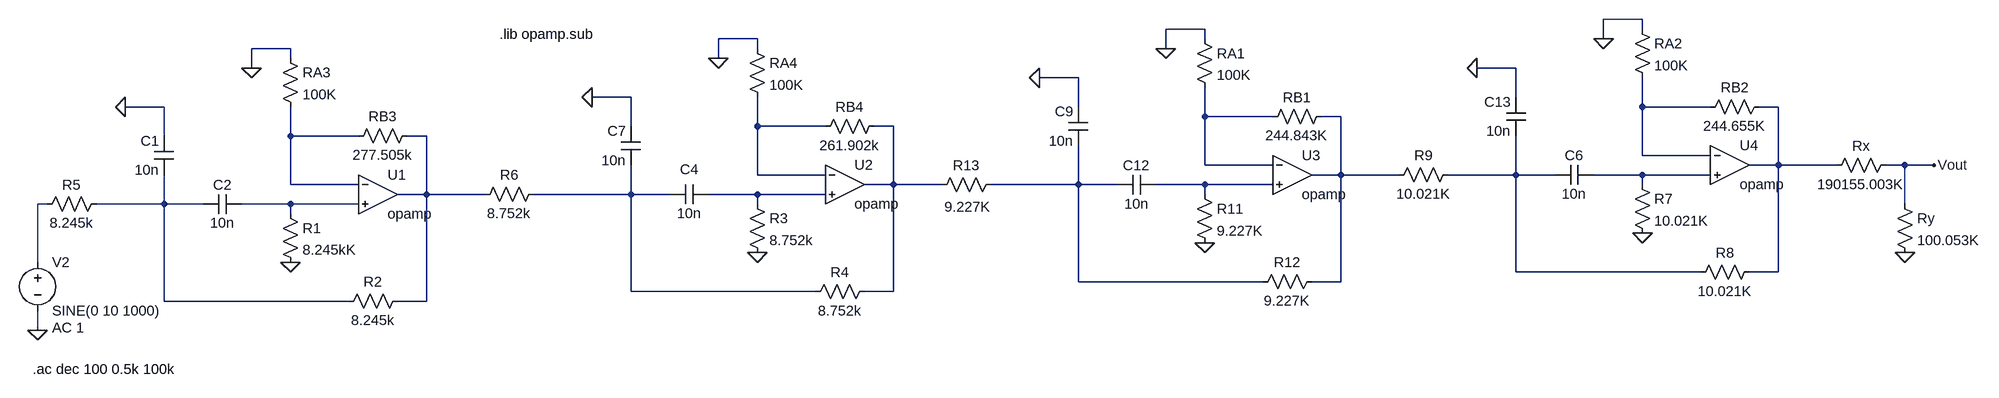
[diagram p0: schematic Passa_bandas wid.asc]
Passa_bandas wid.asc, the LTspice schematic file:
Version 4
SHEET 1 888 680
WIRE 288 -64 224 -64
WIRE -432 -48 -496 -48
WIRE 288 -48 288 -64
WIRE -1168 -32 -1232 -32
WIRE -432 -32 -432 -48
WIRE 224 -32 224 -64
WIRE -1936 -16 -2000 -16
WIRE -1168 -16 -1168 -32
WIRE -496 -16 -496 -48
WIRE -1936 0 -1936 -16
WIRE -1232 0 -1232 -32
WIRE -2000 16 -2000 -16
WIRE 80 16 16 16
WIRE -640 32 -704 32
WIRE -1376 64 -1440 64
WIRE 80 64 80 16
WIRE -2144 80 -2208 80
WIRE -640 80 -640 32
WIRE 288 80 288 32
WIRE 400 80 288 80
WIRE 512 80 480 80
WIRE -432 96 -432 48
WIRE -320 96 -432 96
WIRE -208 96 -240 96
WIRE -1376 112 -1376 64
WIRE -1168 112 -1168 64
WIRE -1056 112 -1168 112
WIRE -944 112 -976 112
WIRE -2144 128 -2144 80
WIRE -1936 128 -1936 80
WIRE -1824 128 -1936 128
WIRE -1712 128 -1744 128
WIRE 288 160 288 80
WIRE 400 160 288 160
WIRE -432 176 -432 96
WIRE -320 176 -432 176
WIRE 512 176 512 80
WIRE 512 176 464 176
WIRE 608 176 512 176
WIRE 720 176 688 176
WIRE 768 176 720 176
WIRE -1168 192 -1168 112
WIRE -1056 192 -1168 192
WIRE -208 192 -208 96
WIRE -208 192 -256 192
WIRE -112 192 -208 192
WIRE 80 192 80 128
WIRE 80 192 -32 192
WIRE 144 192 80 192
WIRE 288 192 208 192
WIRE 400 192 288 192
WIRE -1936 208 -1936 128
WIRE -1824 208 -1936 208
WIRE -944 208 -944 112
WIRE -944 208 -992 208
WIRE -864 208 -944 208
WIRE -640 208 -640 144
WIRE -640 208 -784 208
WIRE -576 208 -640 208
WIRE -432 208 -512 208
WIRE -320 208 -432 208
WIRE 288 208 288 192
WIRE -1712 224 -1712 128
WIRE -1712 224 -1760 224
WIRE -1616 224 -1712 224
WIRE -1376 224 -1376 176
WIRE -1376 224 -1536 224
WIRE -1312 224 -1376 224
WIRE -1168 224 -1248 224
WIRE -1056 224 -1168 224
WIRE -432 224 -432 208
WIRE -2336 240 -2352 240
WIRE -2144 240 -2144 192
WIRE -2144 240 -2256 240
WIRE -2080 240 -2144 240
WIRE -1936 240 -2016 240
WIRE -1824 240 -1936 240
WIRE -1168 240 -1168 224
WIRE 720 240 720 176
WIRE -1936 256 -1936 240
WIRE -2352 336 -2352 240
WIRE 80 352 80 192
WIRE 384 352 80 352
WIRE 512 352 512 176
WIRE 512 352 464 352
WIRE -640 368 -640 208
WIRE -336 368 -640 368
WIRE -208 368 -208 192
WIRE -208 368 -256 368
WIRE -1376 384 -1376 224
WIRE -1072 384 -1376 384
WIRE -944 384 -944 208
WIRE -944 384 -992 384
WIRE -2144 400 -2144 240
WIRE -1840 400 -2144 400
WIRE -1712 400 -1712 224
WIRE -1712 400 -1760 400
WIRE -2352 448 -2352 416
FLAG -432 304 0
FLAG -496 -16 0
FLAG 720 320 0
FLAG 768 176 Vout
FLAG -1936 336 0
FLAG -2000 16 0
FLAG -2352 448 0
FLAG -1168 320 0
FLAG -1232 0 0
FLAG 288 288 0
FLAG 224 -32 0
FLAG -2208 80 0
FLAG -1440 64 0
FLAG -704 32 0
FLAG 16 16 0
SYMBOL res -448 208 R0
SYMATTR InstName R11
SYMATTR Value 9.227K
SYMBOL res -240 352 R90
WINDOW 0 0 56 VBottom 2
WINDOW 3 32 56 VTop 2
SYMATTR InstName R12
SYMATTR Value 9.227K
SYMBOL res -448 -48 R0
SYMATTR InstName RA1
SYMATTR Value 100K
SYMBOL res -224 80 R90
WINDOW 0 0 56 VBottom 2
WINDOW 3 32 56 VTop 2
SYMATTR InstName RB1
SYMATTR Value 244.843K
SYMBOL cap -512 192 R90
WINDOW 0 0 32 VBottom 2
WINDOW 3 32 32 VTop 2
SYMATTR InstName C12
SYMATTR Value 10n
SYMBOL res 704 224 R0
SYMATTR InstName Ry
SYMATTR Value 100.053K
SYMBOL res 704 160 R90
WINDOW 0 0 56 VBottom 2
WINDOW 3 32 56 VTop 2
SYMATTR InstName Rx
SYMATTR Value 190155.003K
SYMBOL OpAmps\\opamp -288 128 R0
SYMATTR InstName U3
SYMBOL res -768 192 R90
WINDOW 0 0 56 VBottom 2
WINDOW 3 37 54 VTop 2
SYMATTR InstName R13
SYMATTR Value 9.227K
SYMBOL res -1952 240 R0
SYMATTR InstName R1
SYMATTR Value 8.245kK
SYMBOL res -1744 384 R90
WINDOW 0 0 56 VBottom 2
WINDOW 3 32 56 VTop 2
SYMATTR InstName R2
SYMATTR Value 8.245k
SYMBOL res -1952 -16 R0
SYMATTR InstName RA3
SYMATTR Value 100K
SYMBOL res -1728 112 R90
WINDOW 0 0 56 VBottom 2
WINDOW 3 32 56 VTop 2
SYMATTR InstName RB3
SYMATTR Value 277.505k
SYMBOL cap -2128 192 R180
WINDOW 0 24 56 Left 2
WINDOW 3 24 8 Left 2
SYMATTR InstName C1
SYMATTR Value 10n
SYMBOL cap -2016 224 R90
WINDOW 0 0 32 VBottom 2
WINDOW 3 32 32 VTop 2
SYMATTR InstName C2
SYMATTR Value 10n
SYMBOL voltage -2352 320 R0
WINDOW 123 24 124 Left 2
WINDOW 39 0 0 Left 0
SYMATTR Value2 AC 1
SYMATTR InstName V2
SYMATTR Value SINE(0 10 1000)
SYMBOL res -1184 224 R0
SYMATTR InstName R3
SYMATTR Value 8.752k
SYMBOL res -976 368 R90
WINDOW 0 0 56 VBottom 2
WINDOW 3 32 56 VTop 2
SYMATTR InstName R4
SYMATTR Value 8.752k
SYMBOL res -1184 -32 R0
SYMATTR InstName RA4
SYMATTR Value 100K
SYMBOL res -960 96 R90
WINDOW 0 0 56 VBottom 2
WINDOW 3 32 56 VTop 2
SYMATTR InstName RB4
SYMATTR Value 261.902k
SYMBOL cap -1248 208 R90
WINDOW 0 -9 32 VBottom 2
WINDOW 3 32 32 VTop 2
SYMATTR InstName C4
SYMATTR Value 10n
SYMBOL OpAmps\\opamp -1792 160 R0
SYMATTR InstName U1
SYMBOL OpAmps\\opamp -1024 144 R0
SYMATTR InstName U2
SYMBOL res -2240 224 R90
WINDOW 0 0 56 VBottom 2
WINDOW 3 32 56 VTop 2
SYMATTR InstName R5
SYMATTR Value 8.245k
SYMBOL res -1520 208 R90
WINDOW 0 0 56 VBottom 2
WINDOW 3 32 56 VTop 2
SYMATTR InstName R6
SYMATTR Value 8.752k
SYMBOL res 272 192 R0
SYMATTR InstName R7
SYMATTR Value 10.021K
SYMBOL res 480 336 R90
WINDOW 0 0 56 VBottom 2
WINDOW 3 32 56 VTop 2
SYMATTR InstName R8
SYMATTR Value 10.021K
SYMBOL res 272 -64 R0
SYMATTR InstName RA2
SYMATTR Value 100K
SYMBOL res 496 64 R90
WINDOW 0 0 56 VBottom 2
WINDOW 3 32 56 VTop 2
SYMATTR InstName RB2
SYMATTR Value 244.655K
SYMBOL cap 208 176 R90
WINDOW 0 0 32 VBottom 2
WINDOW 3 32 32 VTop 2
SYMATTR InstName C6
SYMATTR Value 10n
SYMBOL OpAmps\\opamp 432 112 R0
SYMATTR InstName U4
SYMBOL res -16 176 R90
WINDOW 0 0 56 VBottom 2
WINDOW 3 32 56 VTop 2
SYMATTR InstName R9
SYMATTR Value 10.021K
SYMBOL cap -1360 176 R180
WINDOW 0 24 56 Left 2
WINDOW 3 24 8 Left 2
SYMATTR InstName C7
SYMATTR Value 10n
SYMBOL cap -624 144 R180
WINDOW 0 24 56 Left 2
WINDOW 3 24 8 Left 2
SYMATTR InstName C9
SYMATTR Value 10n
SYMBOL cap 96 128 R180
WINDOW 0 24 56 Left 2
WINDOW 3 24 8 Left 2
SYMATTR InstName C13
SYMATTR Value 10n
TEXT -2360 512 Left 2 !.ac dec 100 0.5k 100k
TEXT -1592 -40 Left 2 !.lib opamp.sub

The netlist it stands for:
* Passa_bandas wid.asc
R11 N012 0 9.227K
R12 N004 N011 9.227K
RA1 0 N003 100K
RB1 N004 N003 244.843K
C12 N012 N011 10n
Ry Vout 0 100.053K
Rx Vout N002 190155.003K
XU3 N003 N012 N004 opamp Aol=100K GBW=10Meg  ; pins invin noninvin out
R13 N011 N006 9.227K
R1 N017 0 8.245kK
R2 N008 N016 8.245k
RA3 0 N007 100K
RB3 N008 N007 277.505k
C1 N016 0 10n
C2 N017 N016 10n
V2 N015 0 SINE(0 10 1000) AC 1
R3 N014 0 8.752k
R4 N006 N013 8.752k
RA4 0 N005 100K
RB4 N006 N005 261.902k
C4 N014 N013 10n
XU1 N007 N017 N008 opamp Aol=100K GBW=10Meg  ; pins invin noninvin out
XU2 N005 N014 N006 opamp Aol=100K GBW=10Meg  ; pins invin noninvin out
R5 N016 N015 8.245k
R6 N013 N008 8.752k
R7 N010 0 10.021K
R8 N002 N009 10.021K
RA2 0 N001 100K
RB2 N002 N001 244.655K
C6 N010 N009 10n
XU4 N001 N010 N002 opamp Aol=100K GBW=10Meg  ; pins invin noninvin out
R9 N009 N004 10.021K
C7 N013 0 10n
C9 N011 0 10n
C13 N009 0 10n
.ac dec 100 0.5k 100k
.lib opamp.sub
.backanno
.end